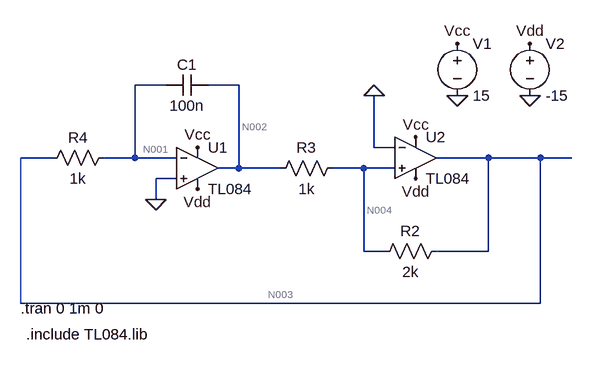
[diagram p0: schematic figa.asc]
figa.asc, the LTspice schematic file:
Version 4
SHEET 1 1028 680
WIRE 112 16 64 16
WIRE 224 16 176 16
WIRE 432 112 432 32
WIRE 464 112 432 112
WIRE -64 128 -112 128
WIRE 64 128 64 16
WIRE 64 128 16 128
WIRE 128 128 64 128
WIRE 608 128 528 128
WIRE 688 128 608 128
WIRE 736 128 688 128
WIRE 224 144 224 16
WIRE 224 144 192 144
WIRE 288 144 224 144
WIRE 416 144 368 144
WIRE 464 144 416 144
WIRE 128 160 96 160
WIRE 96 192 96 160
WIRE 416 272 416 144
WIRE 448 272 416 272
WIRE 608 272 608 128
WIRE 608 272 528 272
WIRE -112 352 -112 128
WIRE 688 352 688 128
WIRE 688 352 -112 352
FLAG 96 192 0
FLAG 560 32 0
FLAG 672 32 0
FLAG 560 -48 Vcc
FLAG 160 112 Vcc
FLAG 496 96 Vcc
FLAG 672 -48 Vdd
FLAG 160 176 Vdd
FLAG 496 160 Vdd
FLAG 432 32 0
SYMBOL res 544 256 R90
WINDOW 0 0 56 VBottom 2
WINDOW 3 32 56 VTop 2
SYMATTR InstName R2
SYMATTR Value 2k
SYMBOL cap 176 0 R90
WINDOW 0 0 32 VBottom 2
WINDOW 3 32 32 VTop 2
SYMATTR InstName C1
SYMATTR Value 100n
SYMBOL voltage 560 -64 R0
WINDOW 123 0 0 Left 0
WINDOW 39 0 0 Left 0
SYMATTR InstName V1
SYMATTR Value 15
SYMBOL voltage 672 -64 R0
WINDOW 123 0 0 Left 0
WINDOW 39 0 0 Left 0
SYMATTR InstName V2
SYMATTR Value -15
SYMBOL res 32 112 R90
WINDOW 0 0 56 VBottom 2
WINDOW 3 32 56 VTop 2
SYMATTR InstName R4
SYMATTR Value 1k
SYMBOL res 384 128 R90
WINDOW 0 0 56 VBottom 2
WINDOW 3 32 56 VTop 2
SYMATTR InstName R3
SYMATTR Value 1k
SYMBOL Opamps\\opamp2 160 80 R0
SYMATTR InstName U1
SYMATTR Value TL084
SYMBOL Opamps\\opamp2 496 64 R0
SYMATTR InstName U2
SYMATTR Value TL084
TEXT -112 360 Left 2 !.tran 0 1m 0
TEXT -104 400 Left 2 !.include TL084.lib

The netlist it stands for:
* figa.asc
R2 N003 N004 2k
C1 N002 N001 100n
V1 Vcc 0 15
V2 Vdd 0 -15
R4 N001 N003 1k
R3 N004 N002 1k
XU1 0 N001 Vcc Vdd N002 TL084  ; pins In+ In- V+ V- OUT
XU2 N004 0 Vcc Vdd N003 TL084  ; pins In+ In- V+ V- OUT
.tran 0 1m 0
.include TL084.lib
.backanno
.end

* Results of the author's LTspice run, read from the files saved beside the schematic
* Operating Point, zero values left out:
*   V(n003) = 11.02 µV
*   V(n004) = -10.97 µV
*   V(n002) = -21.92 µV
*   V(n001) = 10.97 µV
*   V(vcc) = 15 V
*   V(vdd) = -15 V
*   I(R3) = 10.95 nA
*   I(R4) = -45.05 pA
*   I(R2) = 10.99 nA
*   I(V2) = 28.39 mA
*   I(V1) = -28.39 mA
*   Ix(u1:IN+) = 45.05 pA
*   Ix(u1:IN-) = 45.05 pA
*   Ix(u1:V+) = 14.19 mA
*   Ix(u1:V-) = -14.19 mA
*   Ix(u1:OUT) = 10.95 nA
*   Ix(u2:IN+) = 45.05 pA
*   Ix(u2:IN-) = 45.05 pA
*   Ix(u2:V+) = 14.19 mA
*   Ix(u2:V-) = -14.19 mA
*   Ix(u2:OUT) = -11.04 nA
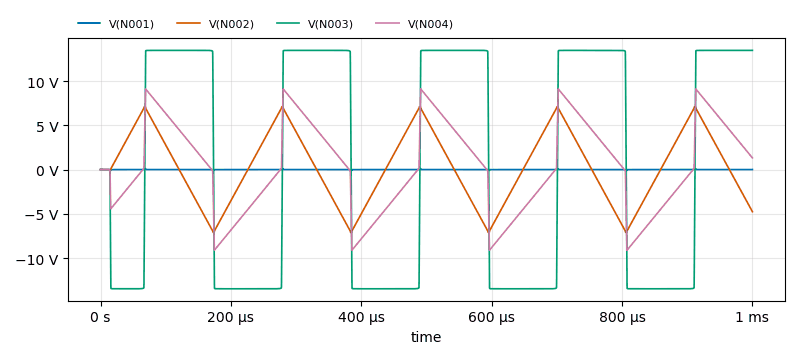
[diagram p1: Transient Analysis of figa.asc, plotted from the saved traces]
* Transient Analysis, 1 run:
*   V(N001): min -110.6 mV, max 106.4 mV, average 367 µV, rms 16.42 mV, last 6.589 mV
*   V(N002): min -7.118 V, max 7.118 V, average 292.3 mV, rms 4.63 V, last -4.757 V
*   V(N003): min -13.48 V, max 13.48 V, average 476.4 mV, rms 13.28 V, last 13.48 V
*   V(N004): min -9.131 V, max 9.129 V, average 353.7 mV, rms 5.353 V, last 1.321 V